# Altium schematic sheet MEGA2560_Rev3e_0.SchDoc: MEGA2560_Rev3e
size 409 x 293 mm; Origin: Eagle; Date: 2/14/2024 10:24:50 AM; SheetNumber: 1; CODE-ARDUINO: DNP; DATASHEET: DNP; DISTRIBUTOR-LINK: DNP; DISTRIBUTOR-PN: DNP; MANUFACTURER: DNP; MANUFACTURER-PN: DNP; NOTE: DNP; Value: DNP; GateName_1: G$1; SymbolName_1: A3L-LOC; LibraryName: Arduino-utility; DeviceSetName: A3-FRAME; Sheet: Sheet:; ReferenceDesignsAREPROVIDED"ASIS"AND"WITHALLFAULTS.ArduinoSADISCLAIMSALLOTHERWARRANTIES,EXPRESSORIMPLIED,
REGARDINGPRODUCTS,INCLUDINGBUTNOTLIMITEDTO,ANYIMPLIEDWARRANTIESOFMERCHANTABILITYORFITNESSFORAPARTICULARPURPOSE

ArduinoSAmaymakechangestospecificationsandproductdescriptionsatanytime,withoutnotice.TheCustomermustnot
relyontheabsenceorcharacteristicsofanyfeaturesorinstructionsmarked"reserved"or"undefined."ArduinoSAreserves
theseforfuturedefinitionandshallhavenoresponsibilitywhatsoeverforconflictsorincompatibilitiesarisingfromfuturechangestothem.
TheproductinformationontheWebSiteorMaterialsissubjecttochangewithoutnotice.Donotfinalizeadesignwiththisinfo

ARDUINOandotherArduinobrandsandlogosandTrademarksofArduinoSA.AllArduinoSATrademarkscannotbeusedwithoutowner'sformalpermission: Reference Designs ARE PROVIDED "AS IS" AND "WITH ALL FAULTS. Arduino SA DISCLAIMS ALL OTHER WARRANTIES, EXPRESS OR IMPLIED, / REGARDING PRODUCTS, INCLUDING BUT NOT LIMITED TO, ANY IMPLIED WARRANTIES OF MERCHANTABILITY OR FITNESS FOR A PARTICULAR PURPOSE / Arduino SA may make changes to specifications and product descriptions at any time, without notice. The Customer must not / rely on the absence or characteristics of any features or instructions marked "reserved" or "undefined." Arduino SA reserves / these for future definition and shall have no responsibility whatsoever for conflicts or incompatibilities arising from future changes to them. / The product information on the Web Site or Materials is subject to change without notice. Do not finalize a design with this info / ARDUINO and other Arduino brands and logos and Trademarks of Arduino SA. All Arduino SA Trademarks cannot be used without owner's formal permission
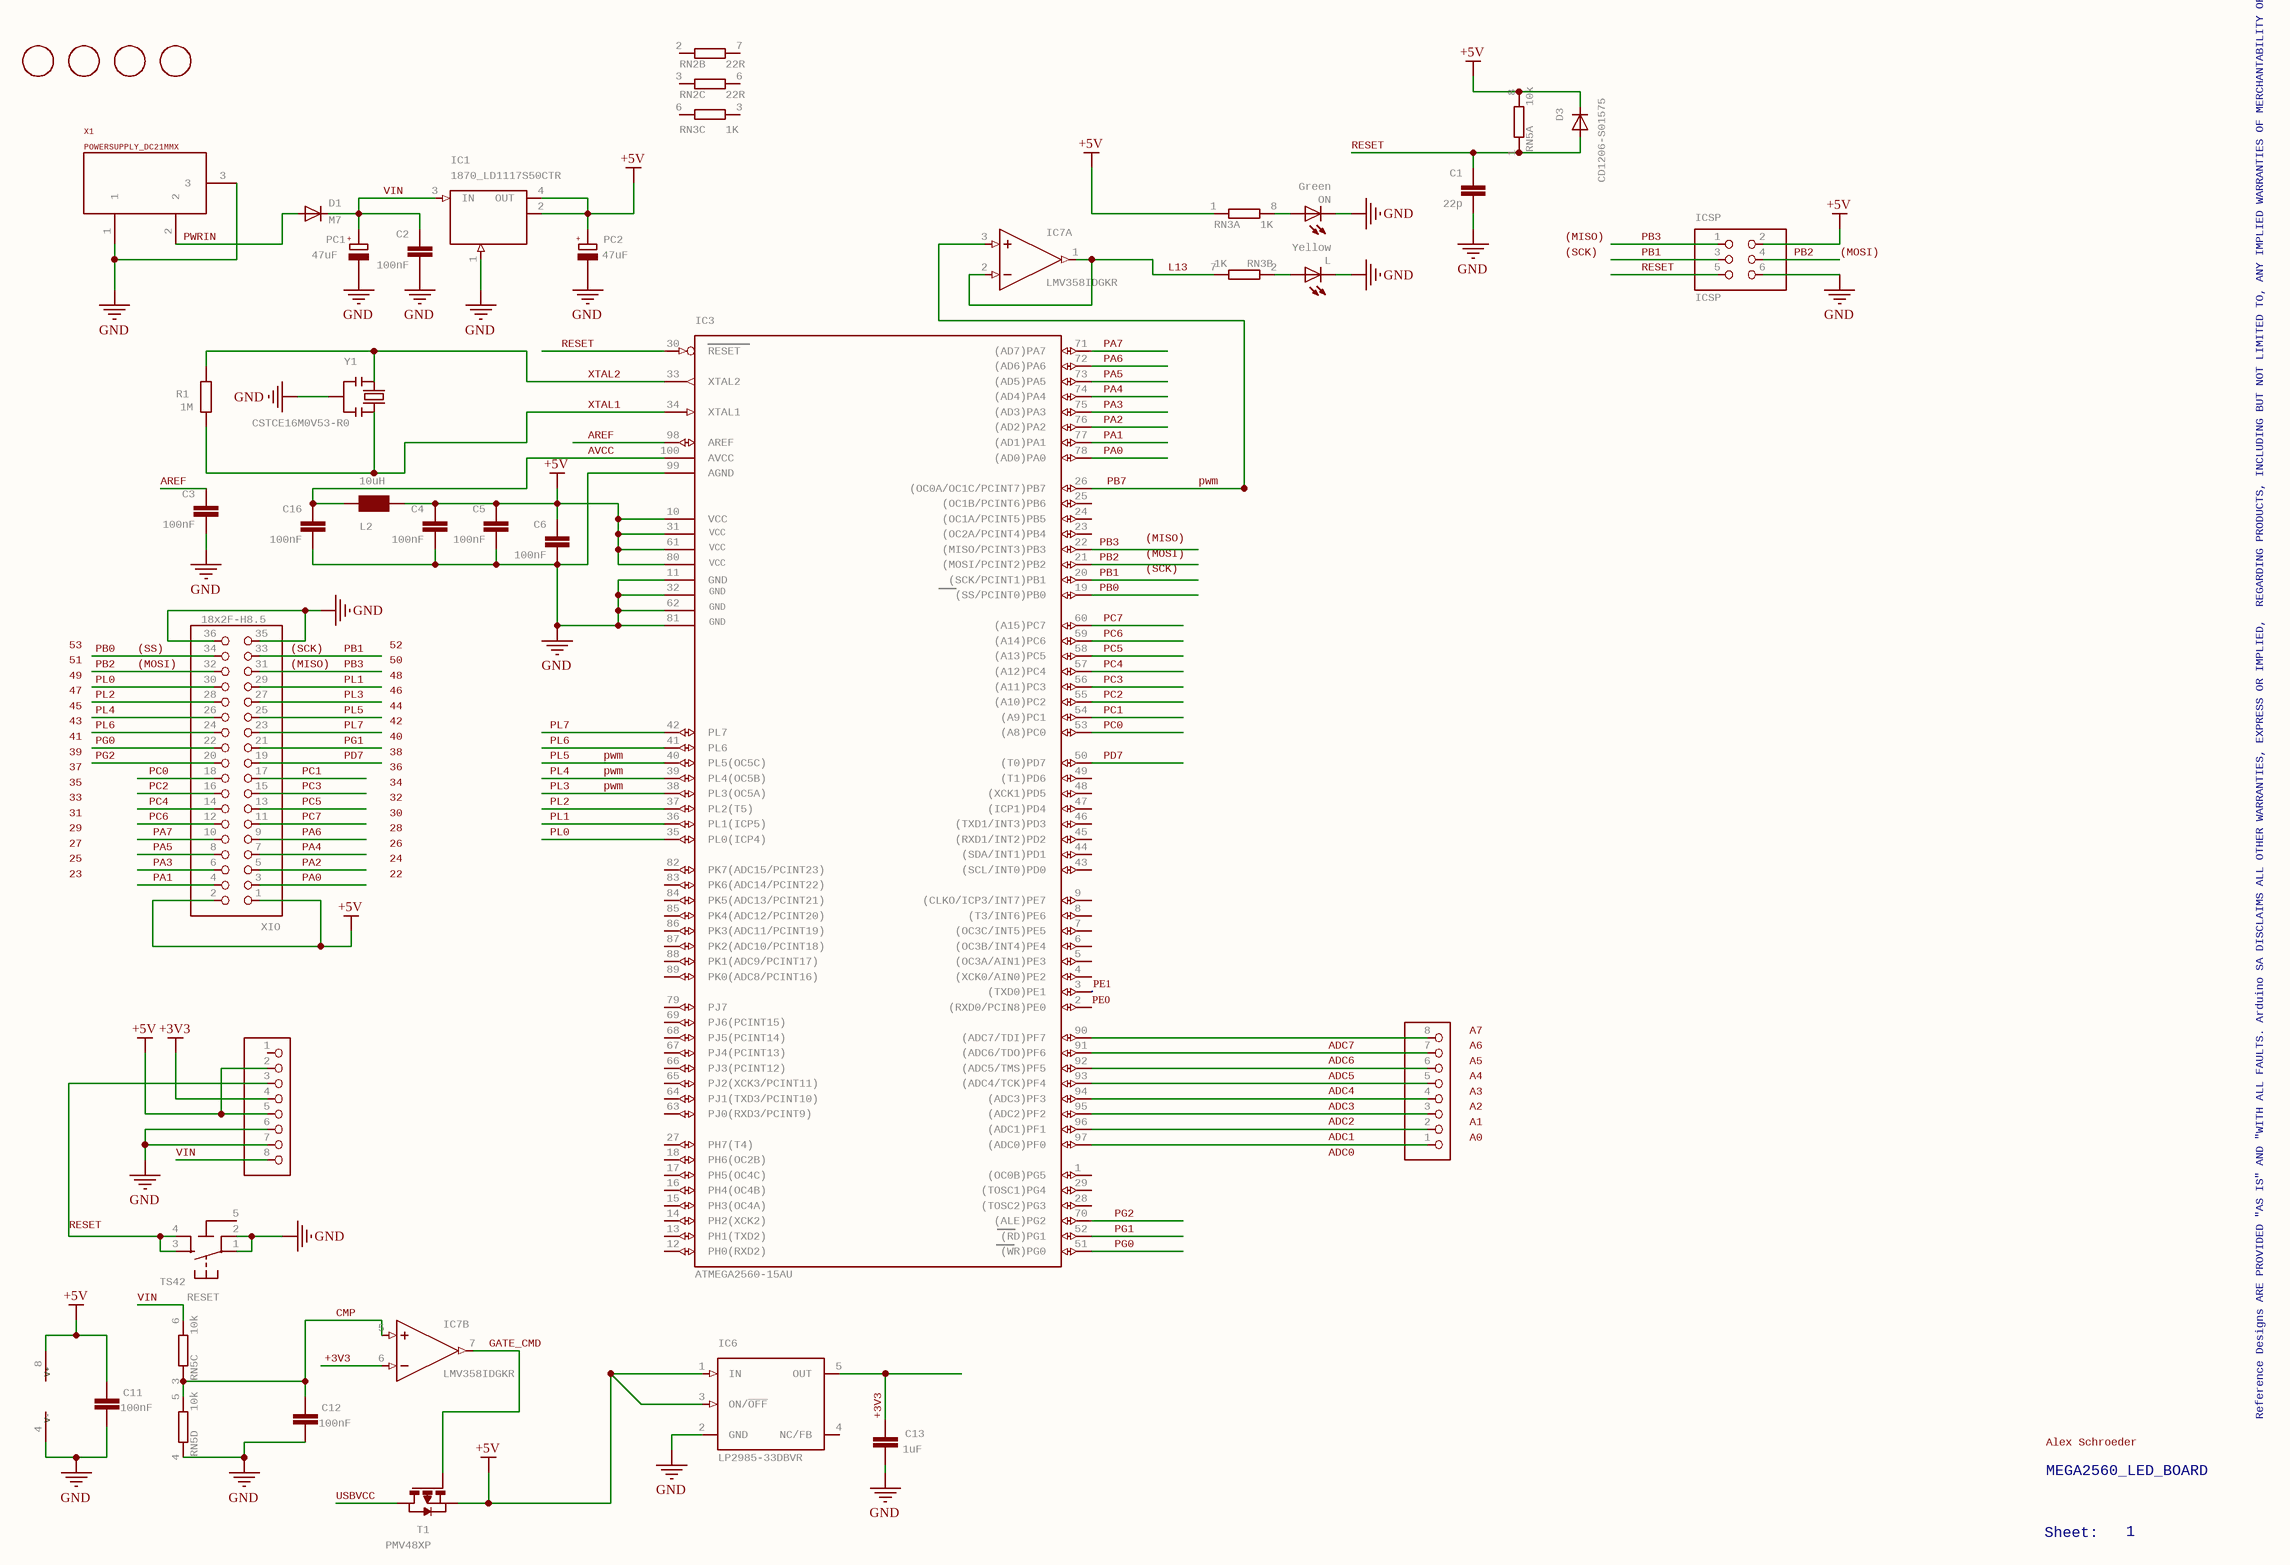
[diagram p0: MEGA2560_Rev3e_0.SchDoc]

## Parts
ADCL  FH254-108DF08500V  [1X08]  (value not drawn)
C1  22p  [C0603-ROUND]
C2  100nF  [C0603-ROUND]
C3  100nF  [C0603-ROUND]
C4  100nF  [C0603-ROUND]
C5  100nF  [C0603-ROUND]
C6  100nF  [C0603-ROUND]
C11  100nF  [C0603-ROUND]
C12  100nF  [C0603-ROUND]
C13  1uF  [C0603-ROUND]
C16  100nF  [C0603-ROUND]
D1  M7  [SMB]
D3  CD1206-S01575  [MINIMELF]
FD1  FIDUCIALMOUNT  [FIDUCIA-MOUNT]  (value not drawn)
FD2  FIDUCIALMOUNT  [FIDUCIA-MOUNT]  (value not drawn)
FD3  FIDUCIALMOUNT  [FIDUCIA-MOUNT]  (value not drawn)
FD4  FIDUCIALMOUNT  [FIDUCIA-MOUNT]  (value not drawn)
IC1  1870_LD1117S50CTR  [LINEAR_SOT223]
IC3  ATMEGA2560-15AU  [TQFP100]
IC6  LP2985-33DBVR  [SOT23-DBV]
IC7  LMV358IDGKR  [MSOP08]  (parts A,B,C of 3)
ICSP  ICSP  [2X03]
L  Yellow  [CHIPLED_0805]
L2  10uH  [0805]
ON  Green  [CHIPLED_0805]
PC1  47uF  [PANASONIC_D]
PC2  47uF  [PANASONIC_D]
POWER  FH254-108DF08500V  [1X08]  (value not drawn)
R1  1M  [R0603-ROUND]
RESET  TS42  [TS42]
RN2  22R  [CAY16]  (parts B,C of 4)
RN3  1K  [CAY16]  (parts A,B,C of 4)
RN5  10k  [CAY16]  (parts A,C,D of 4)
T1  PMV48XP  [SOT-23]
X1  POWERSUPPLY_DC21MMX  [POWERSUPPLY_DC-21MM]
XIO  18x2F-H8.5  [2X18]
Y1  CSTCE16M0V53-R0  [RESONATOR]

## Nets
+3V3: C13.2 IC6.5(OUT) IC7.6(-IN) POWER.4
+5V: C4.1 C5.1 C6.1 C11.2 D3.C IC1.2(OUT) IC1.4(OUT) IC3.10(VCC) IC3.31(VCC1) IC3.61(VCC2) IC3.80(VCC3) IC6.1(IN) IC6.3(ON/~{OFF}) IC7.8(V+) ICSP.2 L2.2 PC2.+ POWER.2 POWER.5 RN3.1 RN5.8 T1.2(S) XIO.1 XIO.2
GND: C1.2 C2.2 C3.2 C4.2 C5.2 C6.2 C11.1 C12.1 C13.1 C16.2 IC1.1(GND/ADJ) IC3.11(GND) IC3.32(GND1) IC3.62(GND2) IC3.81(GND3) IC3.99(AGND) IC6.2(GND) IC7.4(V-) ICSP.6 L.C ON.C PC1.- PC2.- POWER.6 POWER.7 RESET.1 RESET.2 RN5.4 X1.1 X1.3 XIO.35 XIO.36 Y1.2
ADC0: ADCL.1 IC3.97((ADC0)PF0)
ADC1: ADCL.2 IC3.96((ADC1)PF1)
ADC2: ADCL.3 IC3.95((ADC2)PF2)
ADC3: ADCL.4 IC3.94((ADC3)PF3)
ADC4: ADCL.5 IC3.93((ADC4/TCK)PF4)
ADC5: ADCL.6 IC3.92((ADC5/TMS)PF5)
ADC6: ADCL.7 IC3.91((ADC6/TDO)PF6)
ADC7: ADCL.8 IC3.90((ADC7/TDI)PF7)
AREF: C3.1 IC3.98(AREF)
AVCC: C16.1 IC3.100(AVCC) L2.1
CMP: C12.2 IC7.5(+IN) RN5.3 RN5.5
GATE_CMD: IC7.7(OUT) T1.3(G)
L13: IC7.1(OUT) IC7.2(-IN) RN3.7
PA0: IC3.78((AD0)PA0) XIO.3
PA1: IC3.77((AD1)PA1) XIO.4
PA2: IC3.76((AD2)PA2) XIO.5
PA3: IC3.75((AD3)PA3) XIO.6
PA4: IC3.74((AD4)PA4) XIO.7
PA5: IC3.73((AD5)PA5) XIO.8
PA6: IC3.72((AD6)PA6) XIO.9
PA7: IC3.71((AD7)PA7) XIO.10
PB0: IC3.19((SS/PCINT0)PB0) XIO.34
PB1: IC3.20((SCK/PCINT1)PB1) ICSP.3 XIO.33
PB2: IC3.21((MOSI/PCINT2)PB2) ICSP.4 XIO.32
PB3: IC3.22((MISO/PCINT3)PB3) ICSP.1 XIO.31
PB7: IC3.26((OC0A/OC1C/PCINT7)PB7) IC7.3(+IN)
PC0: IC3.53((A8)PC0) XIO.18
PC1: IC3.54((A9)PC1) XIO.17
PC2: IC3.55((A10)PC2) XIO.16
PC3: IC3.56((A11)PC3) XIO.15
PC4: IC3.57((A12)PC4) XIO.14
PC5: IC3.58((A13)PC5) XIO.13
PC6: IC3.59((A14)PC6) XIO.12
PC7: IC3.60((A15)PC7) XIO.11
PD7: IC3.50((T0)PD7) XIO.19
PE0: IC3.2((RXD0/PCIN8)PE0)
PE1: IC3.3((TXD0)PE1)
PG0: IC3.51((WR)PG0) XIO.22
PG1: IC3.52((RD)PG1) XIO.21
PG2: IC3.70((ALE)PG2) XIO.20
PL0: IC3.35(PL0(ICP4)) XIO.30
PL1: IC3.36(PL1(ICP5)) XIO.29
PL2: IC3.37(PL2(T5)) XIO.28
PL3: IC3.38(PL3(OC5A)) XIO.27
PL4: IC3.39(PL4(OC5B)) XIO.26
PL5: IC3.40(PL5(OC5C)) XIO.25
PL6: IC3.41(PL6) XIO.24
PL7: IC3.42(PL7) XIO.23
PWRIN: D1.A X1.2
RESET: C1.1 D3.A IC3.30(RESET) ICSP.5 POWER.3 RESET.3 RESET.4 RN5.1
USBVCC: T1.1(D)
VIN: C2.1 D1.C IC1.3(IN) PC1.+ POWER.8 RN5.6
XTAL1: IC3.34(XTAL1) R1.1 Y1.3
XTAL2: IC3.33(XTAL2) R1.2 Y1.1
NetL_A: L.A RN3.2
NetON_A: ON.A RN3.8

Not connected (* = marked no-connect by the designer): IC3 1((OC0B)PG5) 4((XCK0/AIN0)PE2) 5((OC3A/AIN1)PE3) 6((OC3B/INT4)PE4) 7((OC3C/INT5)PE5) 8((T3/INT6)PE6) 9((CLKO/ICP3/INT7)PE7) 12(PH0(RXD2)) 13(PH1(TXD2)) 14(PH2(XCK2)) 15(PH3(OC4A)) 16(PH4(OC4B)) 17(PH5(OC4C)) 18(PH6(OC2B)) 23((OC2A/PCINT4)PB4) 24((OC1A/PCINT5)PB5) 25((OC1B/PCINT6)PB6) 27(PH7(T4)) 28((TOSC2)PG3) 29((TOSC1)PG4) 43((SCL/INT0)PD0) 44((SDA/INT1)PD1) 45((RXD1/INT2)PD2) 46((TXD1/INT3)PD3) 47((ICP1)PD4) 48((XCK1)PD5) 49((T1)PD6) 63(PJ0(RXD3/PCINT9)) 64(PJ1(TXD3/PCINT10)) 65(PJ2(XCK3/PCINT11)) 66(PJ3(PCINT12)) 67(PJ4(PCINT13)) 68(PJ5(PCINT14)) 69(PJ6(PCINT15)) 79(PJ7) 82(PK7(ADC15/PCINT23)) 83(PK6(ADC14/PCINT22)) 84(PK5(ADC13/PCINT21)) 85(PK4(ADC12/PCINT20)) 86(PK3(ADC11/PCINT19)) 87(PK2(ADC10/PCINT18)) 88(PK1(ADC9/PCINT17)) 89(PK0(ADC8/PCINT16)); IC6 4(NC/FB); POWER 1; RESET 5(5-GND); RN2 2(1) 3(1) 6(2) 7(2); RN3 3(1) 6(2)

## Notes on the sheet
- (SCK)
- (MISO)
- (MOSI)
- pwm
- 53
- (SS)
- (near XIO) (SCK)
- 52
- 51
- 49
- 47
- 45
- 43
- (near XIO) (MOSI)
- (near XIO) (MISO)
- 50
- 48
- 46
- 44
- 42
- 33
- 35
- 37
- 41
- 39
- 32
- 34
- 36
- 40
- 38
- 23
- 25
- 27
- 29
- 31
- 22
- 24
- 26
- 28
- 30
- (near ADCL) A7
- (near ADCL) A6
- (near ADCL) A5
- (near ADCL) A4
- (near ADCL) A3
- (near ADCL) A2
- (near ADCL) A1
- (near ADCL) A0
- Reference Designs ARE PROVIDED "AS IS" AND "WITH ALL FAULTS. Arduino SA DISCLAIMS ALL OTHER WARRANTIES, EXPRESS OR IMPLIED,
  REGARDING PRODUCTS, INCLUDING BUT NOT LIMITED TO, ANY IMPLIED WARRANTIES OF MERCHANTABILITY OR FITNESS FOR A PARTICULAR PURPOSE
  Arduino SA may make changes to specifications and product descriptions at any time, without notice. The Customer must not
  rely on the absence or characteristics of any features or instructions marked "reserved" or "undefined." Arduino SA reserves
  these for future definition and shall have no responsibility whatsoever for conflicts or incompatibilities arising from future changes to them.
  The product information on the Web Site or Materials is subject to change without notice. Do not finalize a design with this info
  ARDUINO and other Arduino brands and logos and Trademarks of Arduino SA. All Arduino SA Trademarks cannot be used without owner's formal permission
- Alex Schroeder
- MEGA2560_LED_BOARD
- Sheet:
- 1

## Library data of the parts
ADCL = 0058_FH254-108DF08500V: Female Connector strip for Arduino bases - 8x1 F V h 8,5 p2,54mm; GateName_1: A; SymbolName_1: PINHD8; MONTHLY_USAGE: _____; LibraryName: Connettori; DeviceSetName: 0058_FH254-108DF08500V; CASE: CASE; PART_NUMBER: FH254-108DF08500V; PRICE: _____; SUPPLIER: _____; TYPE: Connettori
C1 = 0014_22PF_0603: 22pF 0603; GateName_1: G$1; SymbolName_1: C-EU; MONTHLY_USAGE: _____; TYPE: Condensatori; LibraryName: Condensatori; DeviceSetName: 0014_22PF_0603; CASE: 0603; PART_NUMBER: 22pF_0603; PRICE: _____; SUPPLIER: _____
C2-C6 C11 C12 C16 = 0015_100NF_0603: 100nF 0603 50V; PART_NUMBER: cl10b104kbnc; GateName_1: G$1; SymbolName_1: C-EU; MONTHLY_USAGE: _____; TYPE: Condensatori; LibraryName: Condensatori; DeviceSetName: 0015_100NF_0603; CASE: 0603; PRICE: _____; SUPPLIER: _____
C13 = 0006_1UF_0603/GRM188R61E105KA12D: 1uF 0603; GateName_1: G$1; SymbolName_1: C-EU; MONTHLY_USAGE: _____; TYPE: Condensatori; LibraryName: Condensatori; DeviceSetName: 0006_1UF_0603/GRM188R61E105KA12D; CASE: 0603; PART_NUMBER: 1uF_0603/GRM188R61E105KA12D; PRICE: _____; SUPPLIER: _____
D1 = 0020_M7: 1.0A 40V SURFACE MOUNT GLASS PASSIVATED RECTIFIER   M7; GateName_1: G$1; SymbolName_1: D; MONTHLY_USAGE: _____; TYPE: Diodi; LibraryName: Diodi; DeviceSetName: 0020_M7; CASE: SMA; PART_NUMBER: M7; PRICE: _____; SUPPLIER: _____
D3 = 0012_CD1206-S01575: small-signal high-speed Switching Diodes   CD1206; GateName_1: G$1; SymbolName_1: D; MONTHLY_USAGE: _____; TYPE: Diodi; LibraryName: Diodi; DeviceSetName: 0012_CD1206-S01575; CASE: 1206; PART_NUMBER: CD1206-S01575; PRICE: _____; SUPPLIER: _____
FD1-FD4 = FIDUCIALMOUNT: GateName_1: G$1; SymbolName_1: FIDUCIAL; LibraryName: SmartPrj; DeviceSetName: FIDUCIALMOUNT
IC1 = 1870_LD1117S50CTR: Low-dropout linear regulator 5V  -LM1117IMPX-5.0; GateName_1: G$1; SymbolName_1: LINEAR_VREG-O2; MONTHLY_USAGE: _____; LibraryName: IntegratedCircuits; DeviceSetName: 1870_LD1117S50CTR; CASE: SOT223; PART_NUMBER: LD1117S50CTR; PRICE: _____; SUPPLIER: _____; TYPE: Circuito_Integrato
IC3 = 0023_ATMEGA2560-16AU: 8-bit Microcontroller with 256K Bytes In-System Programmable Flash - ATMEGA2560-16AU; GateName_1: 1; SymbolName_1: 86-I/O-1; MONTHLY_USAGE: _____; LibraryName: IntegratedCircuits; DeviceSetName: 0023_ATMEGA2560-16AU; GND: GND; VCC: VCC; CASE: TQFP100_14x14; PART_NUMBER: ATMEGA2560-16AU; PRICE: _____; SUPPLIER: _____; TYPE: Circuito_Integrato
IC6 = 0008_TEXLP2985-33DBVR: 150-mA LOW-NOISE LOW-DROPOUT REGULATOR WITH SHUTDOWN   LP2985-33DBVR; GateName_1: G$1; SymbolName_1: LP2985-XXDBVR; MONTHLY_USAGE: _____; LibraryName: IntegratedCircuits; DeviceSetName: 0008_TEXLP2985-33DBVR; CASE: SOT23-5; PART_NUMBER: TEXLP2985-33DBVR; PRICE: _____; SUPPLIER: _____; TYPE: Circuito_Integrato
IC7 = 0021_LMV358IDGKR: Dual low-voltage (2.7 V to 5.5 V), operational amplifiers with rail-to-rail output swing   LMV358IDGKR; GateName_1: A; SymbolName_1: OPAMP; GateName_2: B; GateName_3: P; SymbolName_3: PWR+-; MONTHLY_USAGE: _____; SymbolName_2: OPAMP; LibraryName: IntegratedCircuits; DeviceSetName: 0021_LMV358IDGKR; CASE: MSOP8; PART_NUMBER: LMV358IDGKR; PRICE: _____; SUPPLIER: _____; TYPE: Circuito_Integrato
ICSP = 0114_PH254-203DF118A00V: 3x2 M V h 8,5 mm p2,54; GateName_1: A; SymbolName_1: PINH2X3; MONTHLY_USAGE: _____; LibraryName: Connettori; DeviceSetName: 0114_PH254-203DF118A00V; CASE: CASE; PART_NUMBER: PH254-203DF118A00V; PRICE: _____; SUPPLIER: _____; TYPE: Connettori
L = 0044_KPT-2012YC: LED YELLOW - SMD - 0805; GateName_1: G$1; MONTHLY_USAGE: _____; SymbolName_1: LED; LibraryName: Opto; DeviceSetName: 0044_KPT-2012YC; CASE: CASE; PART_NUMBER: KPT-2012YC; PRICE: _____; SUPPLIER: _____; TYPE: Opto
L2 = 0715_CV201210-100K: 10uH 0805; GateName_1: G$1; SymbolName_1: L; MONTHLY_USAGE: _____; TYPE: Induttanze; LibraryName: Induttanze; DeviceSetName: 0715_CV201210-100K; CASE: 0805; PART_NUMBER: CV201210-100K; PRICE: _____; SUPPLIER: _____
ON = 0043_KPT-2012SGC: LED GREEN - SMD-0805; GateName_1: G$1; MONTHLY_USAGE: _____; SymbolName_1: LED; LibraryName: Opto; DeviceSetName: 0043_KPT-2012SGC; CASE: CASE; PART_NUMBER: KPT-2012SGC; PRICE: _____; SUPPLIER: _____; TYPE: Opto
PC1 PC2 = 0113_47UF: GateName_1: G$1; SymbolName_1: CPOL; MONTHLY_USAGE: _____; LibraryName: Condensatori; DeviceSetName: 0113_47UF; +: +; CASE: CASE; PART_NUMBER: 47uF; PRICE: _____; SUPPLIER: _____; TYPE: Condensatori
POWER = 1217_FH254-108DF08500T21: Female Connector strip for Arduino bases - 8x1 F V h 8,5 p2,54 serigrafato POWER; GateName_1: A; SymbolName_1: PINHD8; MONTHLY_USAGE: _____; LibraryName: Connettori; DeviceSetName: 1217_FH254-108DF08500T21; CASE: CASE; PART_NUMBER: FH254-108DF08500T21; PRICE: _____; SUPPLIER: _____; TYPE: Connettori
R1 = 0004_0603_1M: 1M 0603; GateName_1: G$1; SymbolName_1: R-EU; MONTHLY_USAGE: _____; LibraryName: Resistenze; DeviceSetName: 0004_0603_1M; CASE: 0603; PART_NUMBER: 0603_1M; PRICE: _____; SUPPLIER: _____; TYPE: Resistenze
RESET = 0946_TS42031-160W-TR-7260: Pushbutton 6x6 Smd - White; PART_NUMBER: IT-1157AHNP-160G-G_GTR; GateName_1: G$1; SymbolName_1: ST-MOD_V1.4_TS42; MONTHLY_USAGE: _____; LibraryName: Switches; DeviceSetName: 0946_TS42031-160W-TR-7260; CASE: CASE; PRICE: _____; SUPPLIER: _____; TYPE: Switches
RN2 = 0003_064R_22R_/_CAY16-220J4LF: 22R 064R; GateName_1: A; SymbolName_1: R1NV; GateName_2: B; GateName_3: C; GateName_4: D; MONTHLY_USAGE: _____; SymbolName_2: R1NV; SymbolName_3: R1NV; SymbolName_4: R1NV; LibraryName: Resistenze; DeviceSetName: 0003_064R_22R_/_CAY16-220J4LF; CASE: SMD_3,2x1,6; PART_NUMBER: 064R_22R_/_CAY16-220J4LF; PRICE: _____; SUPPLIER: _____; TYPE: Resistenze
RN3 = 0005_064R_1K_/_CAY16-102J4LF: 1K 064R; GateName_1: A; SymbolName_1: R1NV; GateName_2: B; GateName_3: C; GateName_4: D; MONTHLY_USAGE: _____; SymbolName_2: R1NV; SymbolName_3: R1NV; SymbolName_4: R1NV; LibraryName: Resistenze; DeviceSetName: 0005_064R_1K_/_CAY16-102J4LF; CASE: SMD_3,2x1,6; PART_NUMBER: 064R_1K_/_CAY16-102J4LF; PRICE: _____; SUPPLIER: _____; TYPE: Resistenze
RN5 = 0016_064R_10K_/_CAY16-103J4LF: 10K 064 R; GateName_1: A; SymbolName_1: R1NV; GateName_2: B; GateName_3: C; GateName_4: D; MONTHLY_USAGE: _____; SymbolName_2: R1NV; SymbolName_3: R1NV; SymbolName_4: R1NV; LibraryName: Resistenze; DeviceSetName: 0016_064R_10K_/_CAY16-103J4LF; CASE: SMD_3,2x1,6; PART_NUMBER: 064R_10K_/_CAY16-103J4LF; PRICE: _____; SUPPLIER: _____; TYPE: Resistenze
T1 = 0297_PMV48XP: 20 V, 3.5 A P-channel Trench MOSFET - PMV48XP; SymbolName_1: P_MOSFET; MONTHLY_USAGE: _____; TYPE: Transistor; GateName_1: A; LibraryName: Transistors; DeviceSetName: 0297_PMV48XP; CASE: SOT23; PART_NUMBER: PMV48XP; PRICE: _____; SUPPLIER: _____
X1 = POWERSUPPLY_DC21MMX: GateName_1: G$1; SymbolName_1: POWERSUPPLY_DC21PWR; DeviceName: X; LibraryName: SmartPrj; DeviceSetName: POWERSUPPLY_DC21MM
XIO = 0060_FH254-218DF08500V: 18x2 F V h 8,5 p2,54; GateName_1: A; SymbolName_1: PINH2X18; MONTHLY_USAGE: _____; LibraryName: Connettori; DeviceSetName: 0060_FH254-218DF08500V; CASE: CASE; PART_NUMBER: FH254-218DF08500V; PRICE: _____; SUPPLIER: _____; TYPE: Connettori
Y1 = 0011_CSTCE16M0V53-R0: 16Mhz - SMD; GateName_1: G$1; MONTHLY_USAGE: _____; SymbolName_1: RESONATOR; LibraryName: Cristalli; DeviceSetName: 0011_CSTCE16M0V53-R0; CASE: CASE; PART_NUMBER: CSTCE16M0V53-R0; PRICE: _____; SUPPLIER: _____; TYPE: Cristalli